# EAGLE design esp32 (EAGLE 7.5.0)
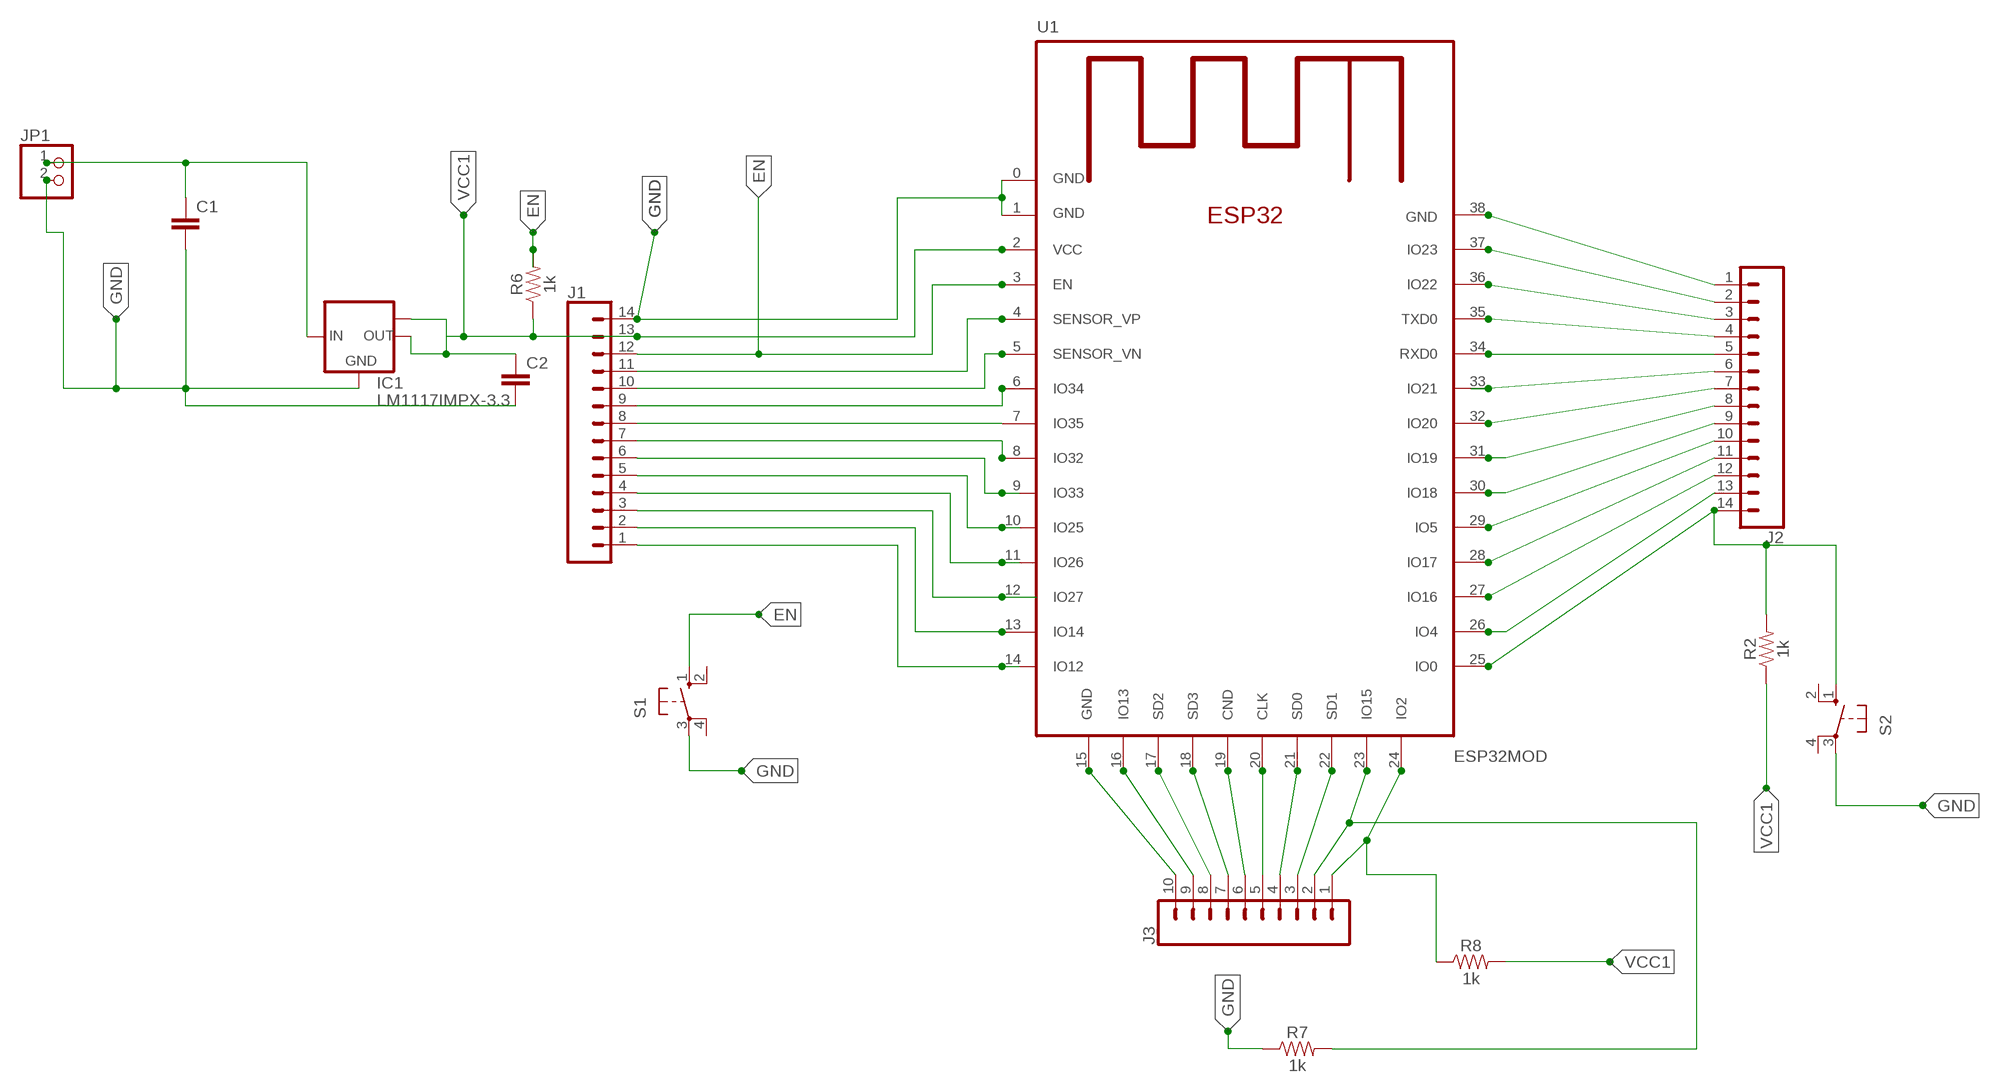
[diagram p0: schematic, sheet 1]

## Parts
C1  C-EU025-050X050  [C025-050X050]
C2  C-EU025-050X050  [C025-050X050]
IC1  LM1117IMPX-3.3  [SOT223]
J1  CONN_14LONGPADS  [1X14-LONGPADS]
J2  CONN_14LONGPADS  [1X14-LONGPADS]
J3  CONN_10"  [1X10]
JP1  PINHD-1X2  [1X02]
R2  1k  1KOHM-HORIZ-1/4W-1%  [AXIAL-0.3]
R6  1k  1KOHM-HORIZ-1/4W-1%  [AXIAL-0.3]
R7  1k  1KOHM-HORIZ-1/4W-1%  [AXIAL-0.3]
R8  1k  1KOHM-HORIZ-1/4W-1%  [AXIAL-0.3]
S1  10-XX  [B3F-10XX]
S2  10-XX  [B3F-10XX]
U1  ESP32MOD  [ESP32MOD]

## Nets
EN: J1.12 R6.P$2 S1.1(S) U1.3(EN)
GND: C1.2 C2.2 IC1.1(GND) J1.14 J2.1 J3.10 JP1.2 R7.P$1 S1.3(P) S2.3(P) U1.0(GND) U1.1(GND) U1.15(GND) U1.38(GND)
N$1: J2.7 U1.32(IO20)
N$2: J1.11 U1.4(SENSOR_VP)
N$3: J1.10 U1.5(SENSOR_VN)
N$5: J2.14 R2.P$2 S2.1(S) U1.25(IO0)
N$6: J1.9 U1.6(IO34)
N$7: J1.8 U1.7(IO35)
N$8: J1.7 U1.8(IO32)
N$9: J1.6 U1.9(IO33)
N$10: J1.5 U1.10(IO25)
N$11: J1.4 U1.11(IO26)
N$12: J1.3 U1.12(IO27)
N$13: J1.2 U1.13(IO14)
N$14: J1.1 U1.14(IO12)
N$15: J2.5 U1.34(RXD0)
N$16: J2.4 U1.35(TXD0)
N$17: J2.3 U1.36(IO22)
N$18: J2.2 U1.37(IO23)
N$19: J2.10 U1.29(IO5)
N$20: J2.6 U1.33(IO21)
N$21: C1.1 IC1.3(IN) JP1.1
N$22: J2.8 U1.31(IO19)
N$23: J2.9 U1.30(IO18)
N$25: J2.11 U1.28(IO17)
N$26: J2.12 U1.27(IO16)
N$27: J2.13 U1.26(IO4)
N$30: J3.9 U1.16(IO13)
N$31: J3.8 U1.17(SD2)
N$32: J3.7 U1.18(SD3)
N$33: J3.6 U1.19(CND)
N$34: J3.5 U1.20(CLK)
N$35: J3.4 U1.21(SD0)
N$36: J3.3 U1.22(SD1)
N$37: J3.2 R7.P$2 U1.23(IO15)
N$38: J3.1 R8.P$1 U1.24(IO2)
VCC1: C2.1 IC1.2(OUT) IC1.TAB(OUT1) J1.13 R2.P$1 R6.P$1 R8.P$2 U1.2(VCC)
Unconnected: S1.2(S1) S1.4(P1) S2.2(S1) S2.4(P1)

## Library data of the parts
C1 C2 = rcl:C-EU: CAPACITOR, European symbol
IC1 = lm1117:LM1117IMPX-*
J1 J2 = SparkFun-Connectors:CONN_14: Multi connection point. Often used as Generic Header-pin footprint for 0.1 inch spaced/style header connections On any of the 0.1 inch spaced packages, you can populate with these: Break Away Headers - Straight <https://www.sparkfun.com/products/116> (PRT-00116) Break Away Male Headers - Right Angle <https://www.sparkfun.com/products/553> (PRT-00553) Female Headers <https://www.sparkfun.com/products/115> (PRT-00115) Break Away Headers - Machine Pin <https://www.sparkfun.com/products/117> (PRT-00117) Break Away Female Headers - Swiss Machine Pin <https://www.sparkfun.com/products/743> (PRT-00743) For SCREWTERMINALS and SPRING TERMINALS visit here: Screw Terimnals on SparkFun.com <https://www.sparkfun.com/search/results?term=Screw+Terminals> (5mm/3.5mm/2.54mm spacing) This device is also useful as a general connection point to wire up your design to another part of your project. Our various solder wires solder well into these plated through hole pads. Hook-Up Wire - Assortment (Stranded, 22 AWG) <https://www.sparkfun.com/products/11375> (PRT-11375) Hook-Up Wire - Assortment (Solid Core, 22 AWG) <https://www.sparkfun.com/products/11367> (PRT-11367) View the entire wire category on our website here <https://www.sparkfun.com/categories/141> Special notes: Molex polarized connector foot print use with SKU : PRT-08231 with associated crimp pins and housings. 1MM SMD Version SKU: PRT-10208 NOTES ON THE VARIANTS LOCK and LOCK_LONGPADS... This footprint was designed to help hold the alignment of a through-hole component (i.e. 6-pin header) while soldering it into place. You may notice that each hole has been shifted either up or down by 0.005 of an inch from it's more standard position (which is a perfectly straight line). This slight alteration caused the pins (the squares in the middle) to touch the edges of the holes. Because they are alternating, it causes a "brace" to hold the component in place. 0.005 has proven to be the perfect amount of "off-center" position when using our standard breakaway headers. Although looks a little odd when you look at the bare footprint, once you have a header in there, the alteration is very hard to notice. Also,if you push a header all the way into place, it is covered up entirely on the bottom side.
J3 = SparkFun-Connectors:CONN_10: Multi connection point. Often used as Generic Header-pin footprint for 0.1 inch spaced/style header connections On any of the 0.1 inch spaced packages, you can populate with these: Break Away Headers - Straight <https://www.sparkfun.com/products/116> (PRT-00116) Break Away Male Headers - Right Angle <https://www.sparkfun.com/products/553> (PRT-00553) Female Headers <https://www.sparkfun.com/products/115> (PRT-00115) Break Away Headers - Machine Pin <https://www.sparkfun.com/products/117> (PRT-00117) Break Away Female Headers - Swiss Machine Pin <https://www.sparkfun.com/products/743> (PRT-00743) Arduino Stackable Header - 10 Pin <https://www.sparkfun.com/products/11376> (PRT-11376) For SCREWTERMINALS and SPRING TERMINALS visit here: Screw Terimnals on SparkFun.com <https://www.sparkfun.com/search/results?term=Screw+Terminals> (5mm/3.5mm/2.54mm spacing) This device is also useful as a general connection point to wire up your design to another part of your project. Our various solder wires solder well into these plated through hole pads. Hook-Up Wire - Assortment (Stranded, 22 AWG) <https://www.sparkfun.com/products/11375> (PRT-11375) Hook-Up Wire - Assortment (Solid Core, 22 AWG) <https://www.sparkfun.com/products/11367> (PRT-11367) View the entire wire category on our website here <https://www.sparkfun.com/categories/141> Special notes: Molex polarized connector foot print use with SKU : PRT-08231 with associated crimp pins and housings. 1MM SMD Version SKU: PRT-10208 NOTES ON THE VARIANTS LOCK and LOCK_LONGPADS... This footprint was designed to help hold the alignment of a through-hole component (i.e. 6-pin header) while soldering it into place. You may notice that each hole has been shifted either up or down by 0.005 of an inch from it's more standard position (which is a perfectly straight line). This slight alteration caused the pins (the squares in the middle) to touch the edges of the holes. Because they are alternating, it causes a "brace" to hold the component in place. 0.005 has proven to be the perfect amount of "off-center" position when using our standard breakaway headers. Although looks a little odd when you look at the bare footprint, once you have a header in there, the alteration is very hard to notice. Also,if you push a header all the way into place, it is covered up entirely on the bottom side.; PROD_ID: CONN-11563
JP1 = pinhead:PINHD-1X2: PIN HEADER
R2 R6-R8 = SparkFun-Resistors:1KOHM: 1kΩ resistor A resistor is a passive two-terminal electrical component that implements electrical resistance as a circuit element. Resistors act to reduce current flow, and, at the same time, act to lower voltage levels within circuits. - Wikipedia; PROD_ID: RES-12182
S1 S2 = switch-omron:10-XX: OMRON SWITCH; MPN: B3F-1000; OC_FARNELL: 176432; OC_NEWARK: 36M3542
U1 = ESP3x:ESP32MOD: ESP32 Module Espressif

## Board
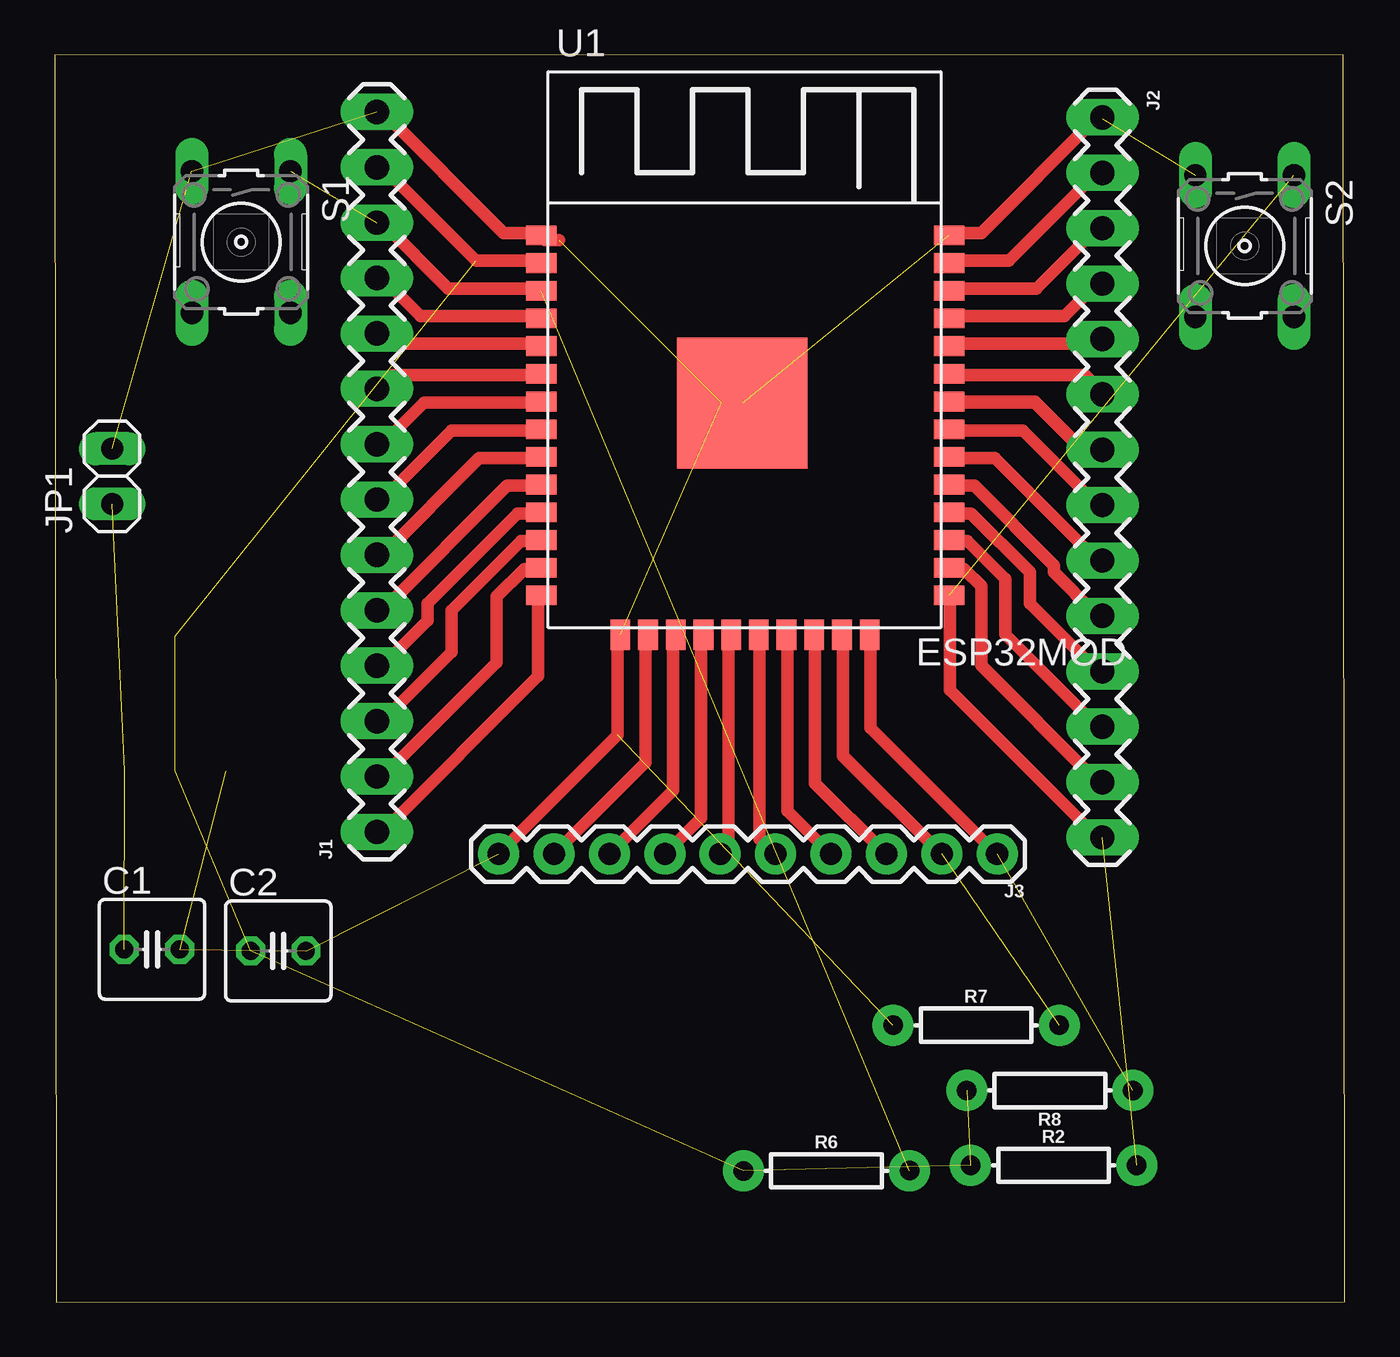
[diagram p1: board, top side]
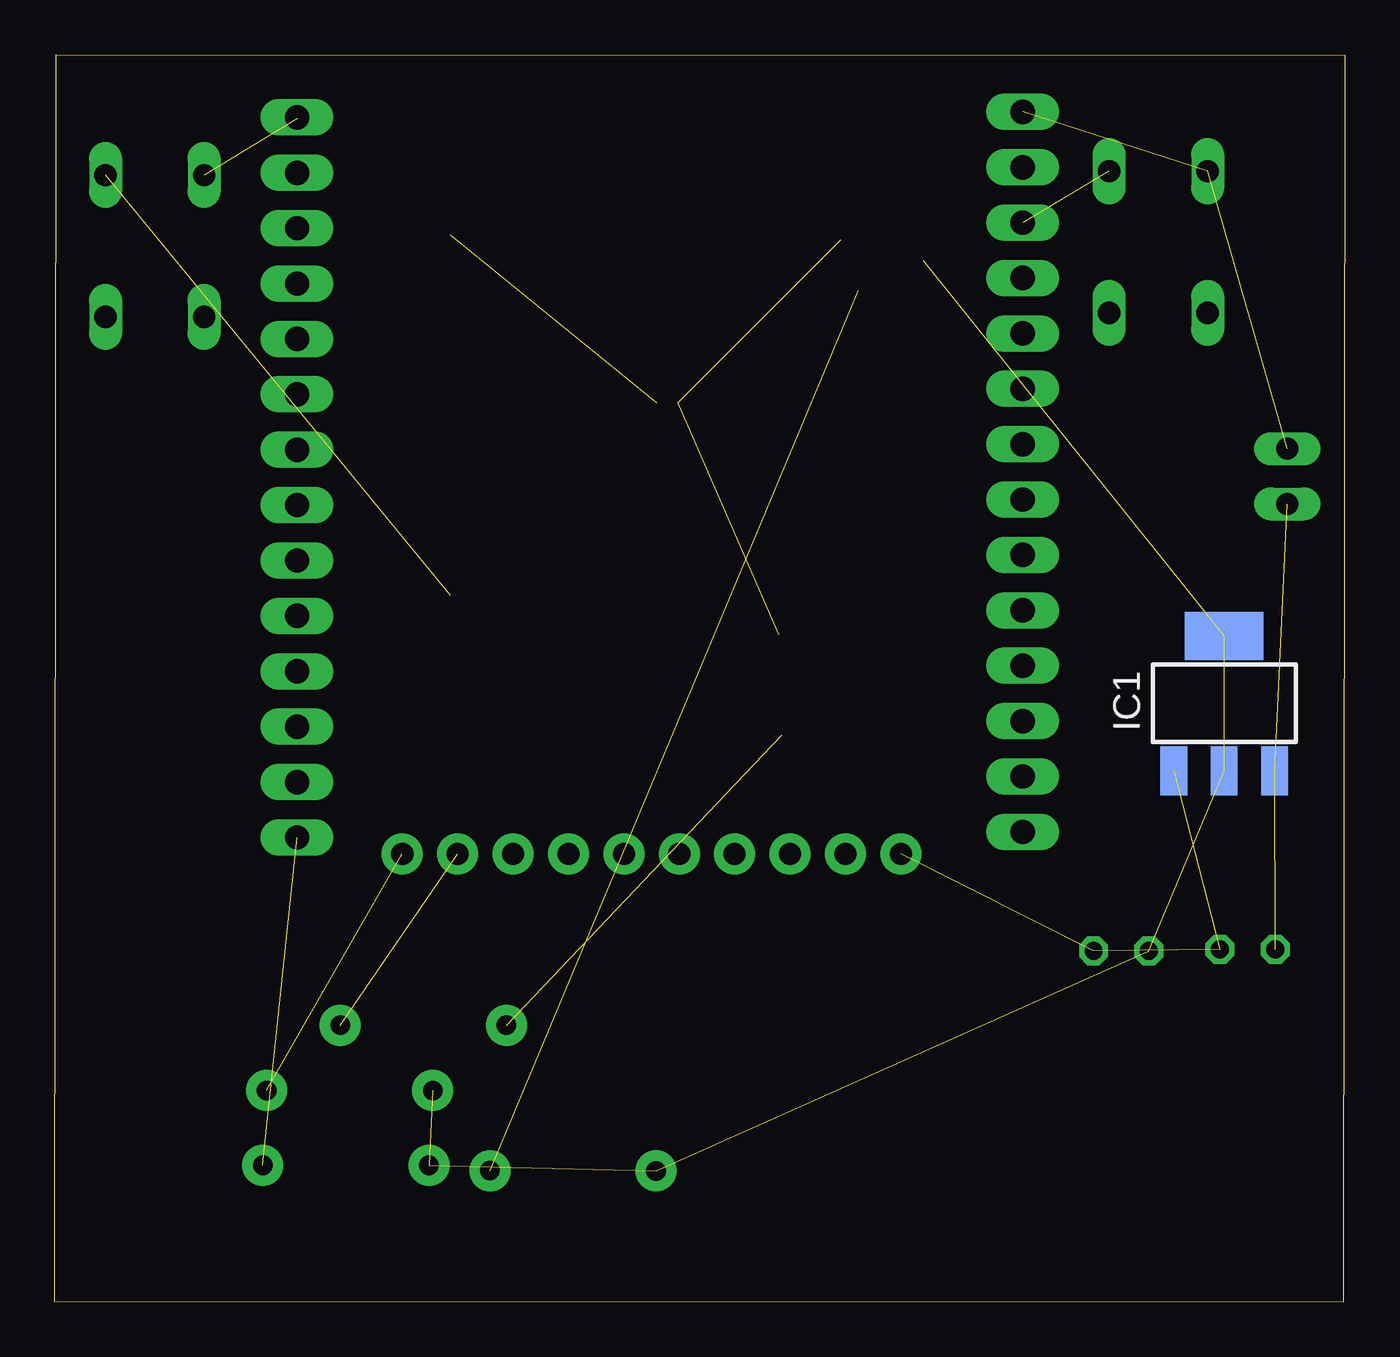
[diagram p2: board, bottom side, seen from below]

Size 59.18 x 57.22 mm. Coordinates in mm from the lower left corner, seen from the top.
Outline: 0.08,0 59.18,0.03 59.11,57.22 0,57.19 0.08,0
Copper layers (1*16): Top 0.035mm / dielectric 1.5mm / Bottom 0.035mm
Design rules "default *": minimum track width 23mil, minimum drill 24mil, track to track 15mil, track to pad 15mil, pad to pad 15mil, via to via 15mil, smd to smd 15mil, copper to edge 40mil, drill to drill 8mil, minimum pad ring 10mil, minimum via ring 8mil, stop-mask expansion 4mil, vias tented up to drill 0mil, thermal gap 10mil

### Footprints (pad centres in the part's own frame; a part is rotated, then mirrored left to right if it is on the bottom)
C025-050X050 = drill 0.813 octagon: 1 -1.27,0; 2 1.27,0
SOT223 = smd 1.219 x 2.235: 1 -2.311,-3.099; 2 0,-3.099; 3 2.311,-3.099 | smd 3.6 x 2.2: TAB 0,3.099
1X14-LONGPADS = drill 1.118 long: 1 0,0; 2 2.54,0; 3 5.08,0; 4 7.62,0; 5 10.16,0; 6 12.7,0; 7 15.24,0; 8 17.78,0; 9 20.32,0; 10 22.86,0; 11 25.4,0; 12 27.94,0; 13 30.48,0; 14 33.02,0
1X10 = drill 1.016 pad 1.88: 1 0,0; 2 2.54,0; 3 5.08,0; 4 7.62,0; 5 10.16,0; 6 12.7,0; 7 15.24,0; 8 17.78,0; 9 20.32,0; 10 22.86,0
1X02 = drill 1.016 long: 1 -1.27,0; 2 1.27,0
AXIAL-0.3 = drill 0.9 pad 1.88: P$1 -3.81,0; P$2 3.81,0
B3F-10XX = drill 1.016 long: 1 -3.251,2.261; 2 3.251,2.261; 3 -3.251,-2.261; 4 3.251,-2.261
ESP32MOD = smd 6 x 6: 0 9.9,12.3 | smd 1.4 x 0.9: 1 0.68,19.99; 2 0.68,18.72; 3 0.68,17.45; 4 0.68,16.18; 5 0.68,14.91; 6 0.68,13.64; 7 0.68,12.37; 8 0.68,11.1; 9 0.68,9.83; 10 0.68,8.56; 11 0.68,7.29; 12 0.68,6.02; 13 0.68,4.75; 14 0.68,3.48; 25 19.38,3.48; 26 19.38,4.75; 27 19.38,6.02; 28 19.38,7.29; 29 19.38,8.56; 30 19.38,9.83; 31 19.38,11.1; 32 19.38,12.37; 33 19.38,13.64; 34 19.38,14.91; 35 19.38,16.18; 36 19.38,17.45; 37 19.38,18.72; 38 19.38,19.99 | smd 0.9 x 1.4: 15 4.31,1.68; 16 5.58,1.68; 17 6.85,1.68; 18 8.12,1.68; 19 9.39,1.68; 20 10.66,1.68; 21 11.93,1.68; 22 13.2,1.68; 23 14.47,1.68; 24 15.74,1.68

### Placement (x,y rotation side)
C1  4.47,16.18 0 top
C2  10.26,16.1 0 top
IC1  5.54,27.46 0 bottom
J1  14.78,21.56 90 top
J2  48.06,54.33 270 top
J3  43.23,20.55 180 top
JP1  2.64,37.87 90 top
R2  45.82,6.27 0 top
R6  35.41,6.02 0.1 top
R7  42.27,12.7 0 top
R8  45.64,9.7 180 top
S1  8.56,48.62 270 top
S2  54.58,48.44 270 top
U1  21.64,28.93 0 top

### Tracks (layer width: path | path; a pad name or v marks a point on that pad's centre or on a via)
EN  (2 unrouted)
  Top 0.584: J1.12 15.04,49.5 18.05,46.49 22.18,46.49 U1.3
GND  (10 unrouted)
  Top 0.584: U1.38 41.07,49.03 42.5,49.03 47.74,54.27 48.06,54.27 J2.1 | J3.10 25.83,26.01 25.83,30.45 U1.15 | J1.14 15.04,54.58 20.59,49.03 22.18,49.03 U1.1 22.5,48.71 23.13,48.71 | 30.59,41.25 31.39,41.25 U1.0
N$1
  Top 0.61: J2.7 47.14,39.09 44.96,41.27 41.05,41.27 U1.32
N$2
  Top 0.584: J1.11 15.04,46.96 16.78,45.22 22.18,45.22 U1.4
N$3
  Top 0.584: U1.5 22.18,43.95 15.35,43.95 14.88,44.42 J1.10
N$5  (2 unrouted)
  Top 0.584: U1.25 41.07,32.36 41.07,28.07 47.74,21.41 48.06,21.41 J2.14
N$6
  Top 0.584: U1.6 22.18,42.52 15.51,42.52 14.88,41.88 J1.9
N$7
  Top 0.584: J1.8 15.04,39.34 16.94,41.25 22.18,41.25 U1.7
N$8
  Top 0.584: J1.7 15.04,36.8 18.21,39.98 22.18,39.98 U1.8
N$9
  Top 0.584: J1.6 15.04,34.26 19.48,38.71 22.18,38.71 U1.9
N$10
  Top 0.584: J1.5 15.04,31.72 20.75,37.44 22.18,37.44 U1.10
N$11
  Top 0.584: J1.4 15.04,29.18 17.1,31.25 17.1,32.04 21.23,36.17 22.18,36.17 U1.11
N$12
  Top 0.584: J1.3 15.04,26.64 18.21,29.82 18.21,31.72 21.39,34.9 22.18,34.9 U1.12
N$13
  Top 0.584: J1.2 15.04,24.1 20.28,29.34 20.28,32.36 21.55,33.63 22.18,33.63 U1.13
N$14
  Top 0.584: J1.1 15.04,21.56 22.18,28.71 22.18,32.36 U1.14
N$15
  Top 0.584: U1.34 41.07,43.95 47.9,43.95 48.06,44.11 J2.5
N$16
  Top 0.584: U1.35 41.07,45.22 46.31,45.22 47.74,46.65 48.06,46.65 J2.4
N$17
  Top 0.584: U1.36 41.07,46.49 45.04,46.49 47.74,49.19 48.06,49.19 J2.3
N$18
  Top 0.584: U1.37 41.07,47.76 43.77,47.76 47.74,51.73 48.06,51.73 J2.2
N$19
  Top 0.584: U1.29 41.07,37.44 42.18,37.44 45.83,33.79 45.83,33.47 47.74,31.57 48.06,31.57 J2.10
N$20
  Top 0.584: U1.33 41.07,42.52 47.26,42.52 48.06,41.73 J2.6
N$21  (2 unrouted)
N$22
  Top 0.584: U1.31 41.07,39.98 44.41,39.98 47.74,36.65 48.06,36.65 J2.8
N$23
  Top 0.584: U1.30 41.07,38.71 43.14,38.71 47.74,34.11 48.06,34.11 J2.9
N$25
  Top 0.584: U1.28 41.07,36.17 42.02,36.17 44.72,33.47 44.72,32.04 47.74,29.03 48.06,29.03 J2.11
N$26
  Top 0.584: U1.27 41.07,34.9 41.87,34.9 43.61,33.15 43.61,30.61 47.74,26.49 48.06,26.49 J2.12
N$27
  Top 0.584: U1.26 41.07,33.63 41.71,33.63 42.5,32.84 42.5,29.18 47.74,23.95 48.06,23.95 J2.13
N$30
  Top 0.584: J3.9 27.1,24.74 27.1,30.45 U1.16
N$31
  Top 0.584: J3.8 28.37,23.47 28.37,30.45 U1.17
N$32
  Top 0.584: J3.7 29.64,22.2 29.64,30.45 U1.18
N$33
  Top 0.584: J3.6 30.91,20.93 30.91,30.45 U1.19
N$34
  Top 0.584: U1.20 32.34,30.45 32.34,21.25 32.98,20.61 J3.5
N$35
  Top 0.584: U1.21 33.61,30.45 33.61,22.52 35.52,20.61 J3.4
N$36
  Top 0.584: U1.22 34.88,30.45 34.88,23.79 38.06,20.61 J3.3
N$37  (1 unrouted)
  Top 0.584: U1.23 36.15,30.45 36.15,25.06 40.6,20.61 J3.2
N$38  (1 unrouted)
  Top 0.584: U1.24 37.42,30.45 37.42,26.33 43.14,20.61 J3.1
VCC1  (6 unrouted)
  Top 0.584: J1.13 15.04,52.04 19.32,47.76 22.18,47.76 U1.2